# Altium schematic sheet PCB_DYBoard_Bandmaster_V2_SCH2.SchDoc
size A4; SheetNumber: 2; SheetTotal: 4
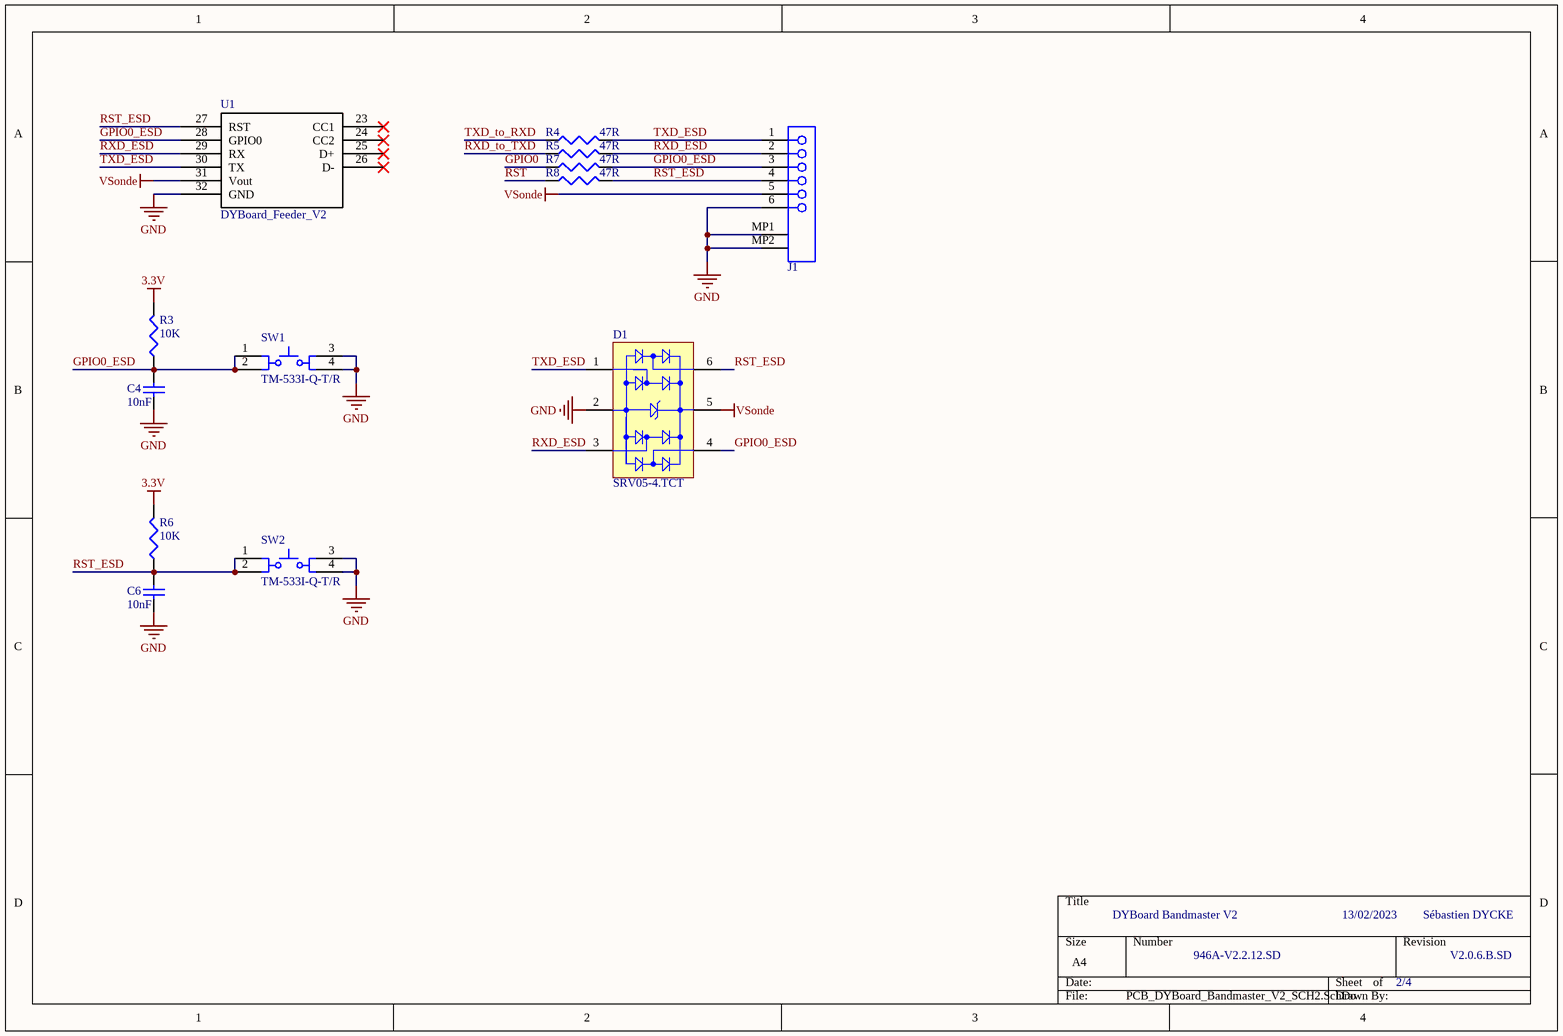
[diagram p0: PCB_DYBoard_Bandmaster_V2_SCH2.SchDoc]

## Parts
C4  value 10nF  [1608[0603]]  (hidden comment: Cap Semi)
C6  value 10nF  [1608[0603]]  (hidden comment: Cap Semi)
D1  SRV05-4.TCT  [SMTC-SOT23-6_V]
J1  SEB_MOLeX_6p  [SEB_MOLeX_6p]  (value not drawn)
R3  value 10K  [J1-0603]  (hidden comment: Res3)
R4  value 47R  [J1-0603]  (hidden comment: Res3)
R5  value 47R  [J1-0603]  (hidden comment: Res3)
R6  value 10K  [J1-0603]  (hidden comment: Res3)
R7  value 47R  [J1-0603]  (hidden comment: Res3)
R8  value 47R  [J1-0603]  (hidden comment: Res3)
SW1  TM-533I-Q-T/R  [MULT-TM-533I-Q_V]
SW2  TM-533I-Q-T/R  [MULT-TM-533I-Q_V]
U1  DYBoard_Feeder_V2  [DYBoard_Feeder_V2]

## Nets
3.3V: R3.2 R6.2
GND: C4.1 C6.1 D1.2(GND) J1.6 J1.MP1 J1.MP2 SW1.3 SW1.4 SW2.3 SW2.4 U1.32(GND)
VSonde: D1.5(VBUS) J1.5 U1.31(Vout)
GPIO0: R7.1
GPIO0_ESD: C4.2 D1.4(I/O_3) J1.3 R3.1 R7.2 SW1.1 SW1.2 U1.28(GPIO0)
RST: R8.1
RST_ESD: C6.2 D1.6(I/O_4) J1.4 R6.1 R8.2 SW2.1 SW2.2 U1.27(RST)
RXD_ESD: D1.3(I/O_2) J1.2 R5.2 U1.29(RX)
RXD_to_TXD: R5.1
TXD_ESD: D1.1(I/O_1) J1.1 R4.2 U1.30(TX)
TXD_to_RXD: R4.1

Not connected (* = marked no-connect by the designer): U1 23(CC1)* 24(CC2)* 25(D+)* 26(D-)*

## Notes on the sheet
- DYBoard Bandmaster V2
- 13/02/2023
- Sébastien DYCKE
- 946A-V2.2.12.SD
- 2/4
- V2.0.6.B.SD

## Library data of the parts
C4 C6 = Cap Semi: Capacitor (Semiconductor SIM Model); Published: 8-Jun-2000; LatestRevisionDate: 29-May-2009; LatestRevisionNote: IPC-7351 Footprint Added.; PackageReference: C1206; Publisher: Altium Limited; PackageDescription: Chip Capacitor
D1 = CMP-2000-05358-1: RailClamp(R) Low Capacitance TVS Diode Array, 5 pF, 17.5 VC, -55 to 125 degC, 6-Pin SOT23, RoHS, Tape and Reel; Manufacturer: Semtech; Leakage Current (Max): 5uA; Polarity: Uni-Directional; Peak Pulse Power Dissipation: 300W; Clamping Voltage: 17.5V; Number of Elements: 1; Working Voltage: 5V; Test Current (It): 1mA; Configuration: Quad; Reverse Breakdown Voltage: 6V; Suppressor Type: DiodeArrays; Peak Pulse Current: 12A; Product Depth (mm): 1.6mm; Product Height (mm): 1.15mm; Clamping Voltage (Max): 12.5V; Rad Hardened: No; Product Length (mm): 2.9mm; Capacitance Value: 5pF; Mounting: SurfaceMount; Datasheet URL: https://datasheet.ciiva.com/8029/srv05-4-8029973.pdf; Datasheet Version: Jan-08; Packaging: TapeandReel; Package / Case: SOT-23; Operating Temp Range: -55Cto125C; Pin Count: 6; Direction Type: Uni-Directional; Operating Temperature Min Deg. C: -55C; Reverse Stand-off Voltage: 5V; Leakage Current: 5uA; Manufacturer URL: http://www.semtech.com/; Working Voltage (Max): 5V; Package Reference: SOT23-6; Package Description: 6-Pin Small Outline Transistor, Body 2.9 x 1.6 mm, Pitch 0.95 mm; Operating Temperature Max Deg. C: 125C; Operating Temperature Classification: Military; Mounting Style: SurfaceMount
R3-R8 = Res3: Resistor; Published: 8-Jun-2000; LatestRevisionDate: 29-May-2009; LatestRevisionNote: IPC-7351 Footprint Added.; PackageReference: J1-0603; Publisher: Altium Limited; PackageDescription: Chip Resistor
SW1 SW2 = CMP-1762-00001-1: TACT Switch, SPNO, -25 to 70 degC, 4-Pin SMD, RoHS, Tape and Reel; PackageDescription: 4-Pin Surface Mount Device, Body 5.2 x 5.2 mm; PackageReference: TM-533I-Q-T/R; DatasheetVersion: Rev. 1.1, 12/2011; ComponentLink1Description: Datasheet; ComponentLink1URL: http://www.micropik.com/PDF/pul5x5.pdf